# Altium schematic sheet Input.SchDoc
size A4
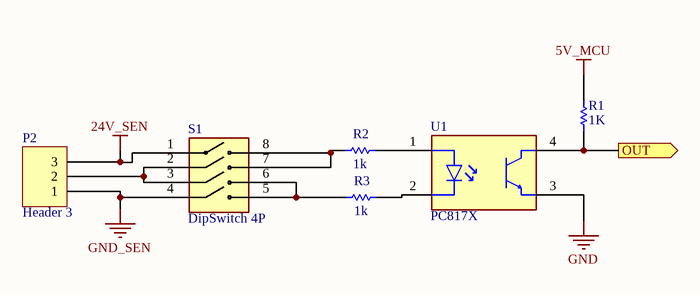
[diagram p0: Input.SchDoc]

## Parts
P2  Header 3  [HDR1X3]
R1  value 1K  [SMT0805_M]  (hidden comment: 0805/.125W/5Q)
R2  value 1k  [SMT0805_M]  (hidden comment: 0805/.125W/5Q)
R3  value 1k  [SMT0805_M]  (hidden comment: 0805/.125W/5Q)
S1  DipSwitch 4P  [DS-04]
U1  PC817X  [DIP-4]

## Ports
OUT (out)

## Nets
5V_MCU: R1.2
24V_SEN: P2.3 S1.1
GND: U1.3(E)
GND_SEN: P2.1 S1.4
OUT: R1.1 U1.4(C) ; port OUT
NetP2_2: P2.2 S1.2 S1.3
NetR2_1: R2.1 S1.7 S1.8
NetR2_2: R2.2 U1.1(A)
NetR3_1: R3.1 S1.5 S1.6
NetR3_2: R3.2 U1.2(K)

## Library data of the parts
P2 = Header 3: Header, 3-Pin; LatestRevisionDate: 17-Jul-2002; LatestRevisionNote: Re-released for DXP Platform.; Publisher: Altium Limited
R1-R3 = Res1: Resistor; Published: 8-Jun-2000; LatestRevisionDate: 17-Jul-2002; LatestRevisionNote: Re-released for DXP Platform.; PackageReference: AXIAL-0.3; Publisher: Altium Limited; PackageDescription: Axial Device, Thru-Hole; 2 Leads; 0.3 in Pin Spacing
S1 = DS-04